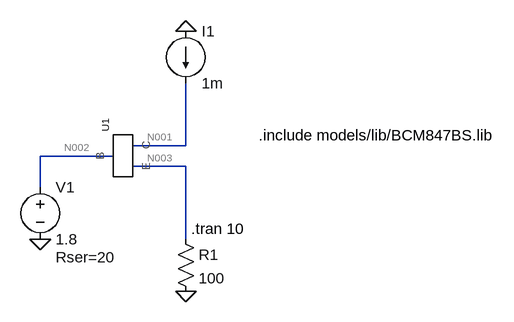
[diagram p0: schematic test.asc]
test.asc, the LTspice schematic file:
Version 4.1
SHEET 1 880 680
WIRE 144 64 144 -32
WIRE 144 64 64 64
WIRE 32 80 -80 80
WIRE 144 96 64 96
WIRE -80 128 -80 80
WIRE 144 208 144 96
FLAG 144 -112 0
FLAG 144 288 0
FLAG -80 208 0
SYMBOL voltage -80 112 R0
WINDOW 123 0 0 Left 0
WINDOW 39 24 124 Left 2
SYMATTR SpiceLine Rser=20
SYMATTR InstName V1
SYMATTR Value 1.8
SYMBOL current 144 -112 R0
WINDOW 123 0 0 Left 0
WINDOW 39 0 0 Left 0
SYMATTR InstName I1
SYMATTR Value 1m
SYMBOL res 128 192 R0
SYMATTR InstName R1
SYMATTR Value 100
SYMBOL sym\\BCM847BS\\BCM847BS 48 32 R270
SYMATTR InstName U1
TEXT 256 48 Left 2 !.include models/lib/BCM847BS.lib
TEXT 152 192 Left 2 !.tran 10

The netlist it stands for:
* test.asc
V1 N002 0 1.8 Rser=20
I1 0 N001 1m
R1 N003 0 100
X§U1 N003 N002 N001 BCM847BS BCM847BS  ; pins E B C
.include models/lib/BCM847BS.lib
.tran 10
.backanno
.end

* Results of the author's LTspice run, read from the files saved beside the schematic
* Operating Point, zero values left out:
*   V(n001) = 869.6 mV
*   V(n002) = 1.648 V
*   V(n003) = 862 mV
*   I(V1) = -7.62 mA
*   I(R1) = 8.62 mA
*   I(I1) = 1 mA
*   Ix(u1:1) = -8.62 mA
*   Ix(u1:2) = 7.62 mA
*   Ix(u1:3) = 1 mA